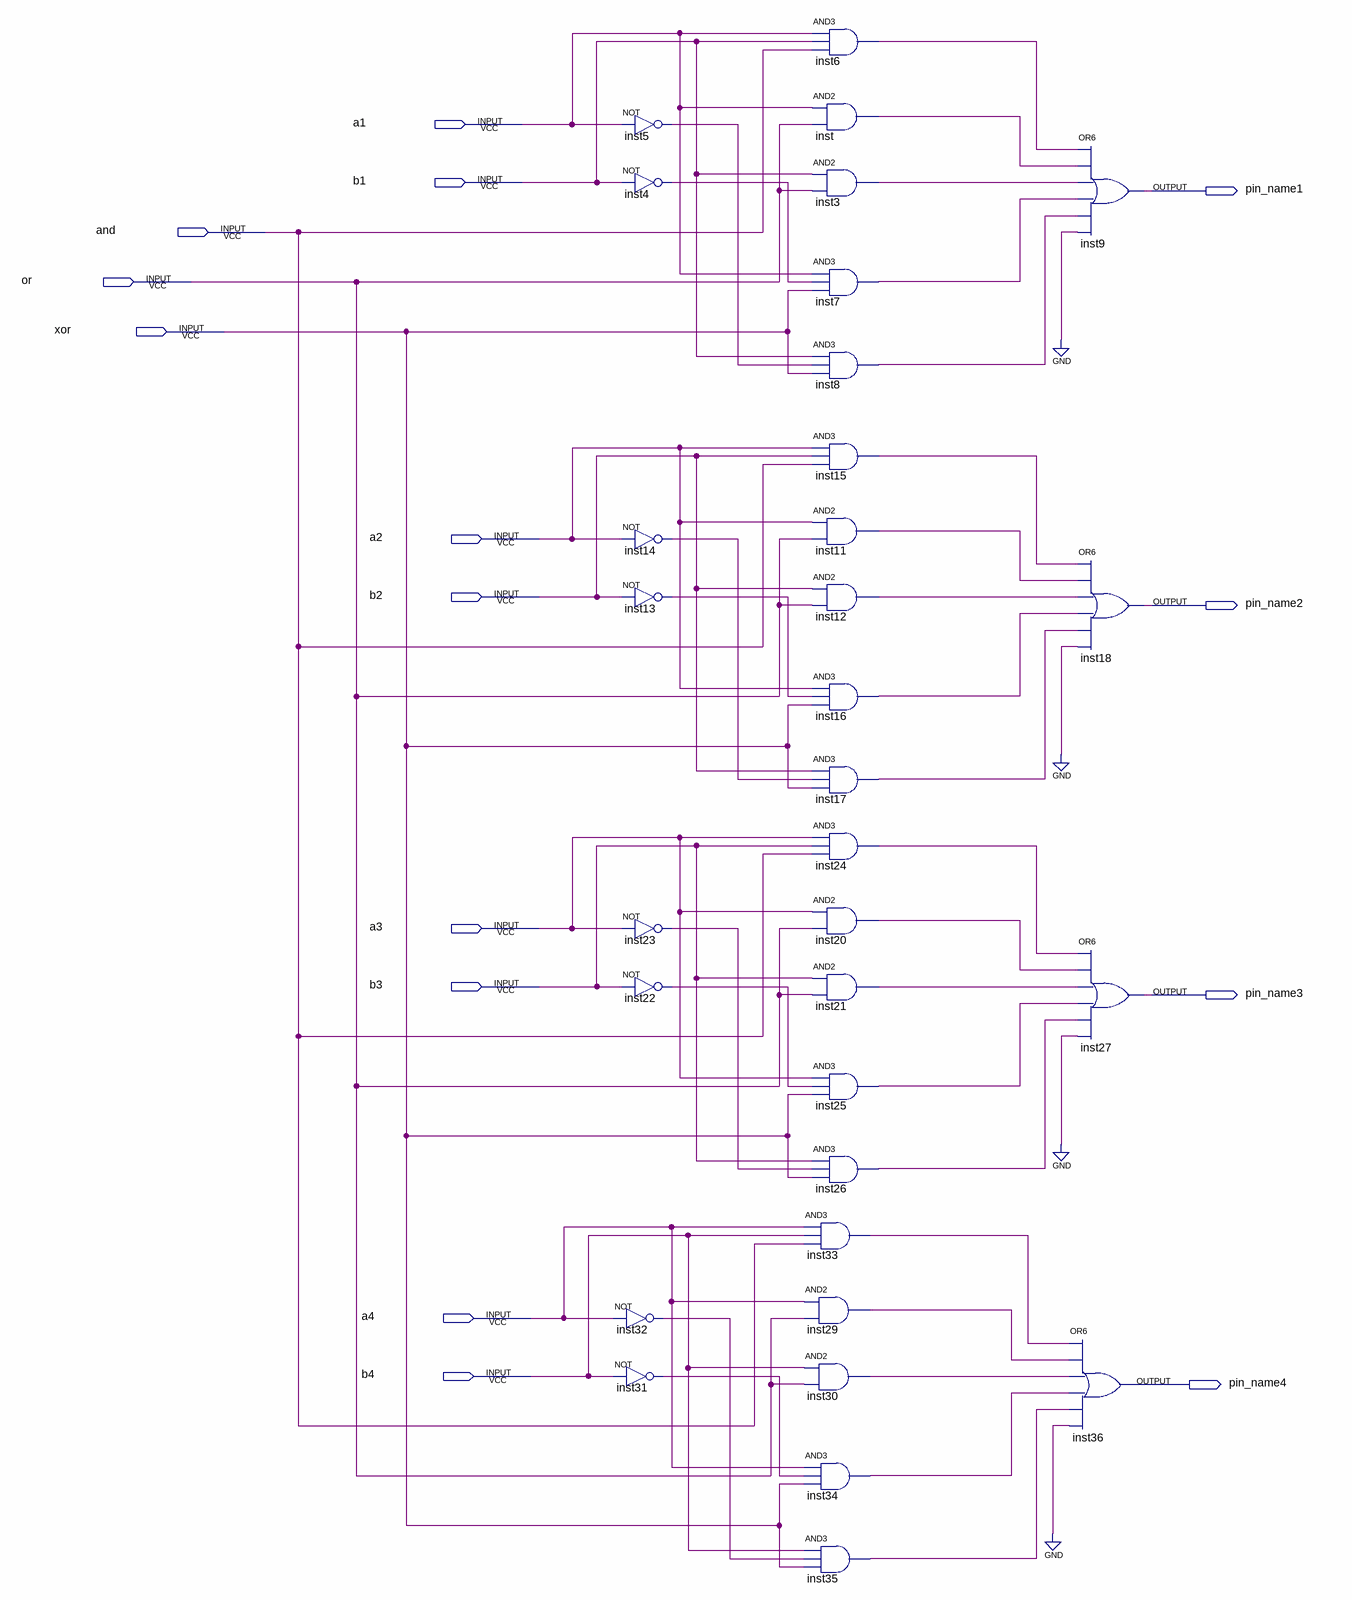
[diagram p0: schematic sheet]
// Quartus schematic simple.bdf as structural Verilog: 32 symbols, 15 pins
module simple (
  input  a1,
  input  b1,
  input  \and ,
  input  \or ,
  input  \xor ,
  input  a2,
  input  b2,
  input  a3,
  input  b3,
  input  a4,
  input  b4,
  output pin_name1,
  output pin_name2,
  output pin_name3,
  output pin_name4
);

  wire inst3_out, inst4_out, inst5_out, inst6_out, inst7_out, inst8_out, inst11_out, inst12_out, inst13_out,
       inst14_out, inst15_out, inst16_out, inst17_out, inst20_out, inst21_out, inst22_out, inst23_out,
       inst24_out, inst25_out, inst26_out, inst29_out, inst30_out, inst31_out, inst32_out, inst33_out,
       inst34_out, inst35_out, inst_out;

  not inst5 (inst5_out, a1);
  not inst4 (inst4_out, b1);
  not inst14 (inst14_out, a2);
  not inst13 (inst13_out, b2);
  not inst23 (inst23_out, a3);
  not inst22 (inst22_out, b3);
  not inst32 (inst32_out, a4);
  not inst31 (inst31_out, b4);
  and inst6 (inst6_out, a1, b1, \and );
  and inst (inst_out, a1, \or );
  and inst3 (inst3_out, b1, \or );
  and inst7 (inst7_out, a1, inst4_out, \xor );
  and inst8 (inst8_out, b1, inst5_out, \xor );
  and inst15 (inst15_out, a2, b2, \and );
  and inst11 (inst11_out, a2, \or );
  and inst12 (inst12_out, b2, \or );
  and inst16 (inst16_out, a2, inst13_out, \xor );
  and inst17 (inst17_out, b2, inst14_out, \xor );
  and inst24 (inst24_out, a3, b3, \and );
  and inst20 (inst20_out, a3, \or );
  and inst21 (inst21_out, b3, \or );
  and inst25 (inst25_out, a3, inst22_out, \xor );
  and inst26 (inst26_out, b3, inst23_out, \xor );
  and inst33 (inst33_out, a4, b4, \and );
  and inst29 (inst29_out, a4, \or );
  and inst30 (inst30_out, b4, \or );
  and inst34 (inst34_out, a4, inst31_out, \xor );
  and inst35 (inst35_out, b4, inst32_out, \xor );
  or inst9 (pin_name1, inst6_out, inst_out, inst3_out, inst7_out, inst8_out, 1'b0);
  or inst18 (pin_name2, inst15_out, inst11_out, inst12_out, inst16_out, inst17_out, 1'b0);
  or inst27 (pin_name3, inst24_out, inst20_out, inst21_out, inst25_out, inst26_out, 1'b0);
  or inst36 (pin_name4, inst33_out, inst29_out, inst30_out, inst34_out, inst35_out, 1'b0);
endmodule
